# Altium project EM.PrjPcb
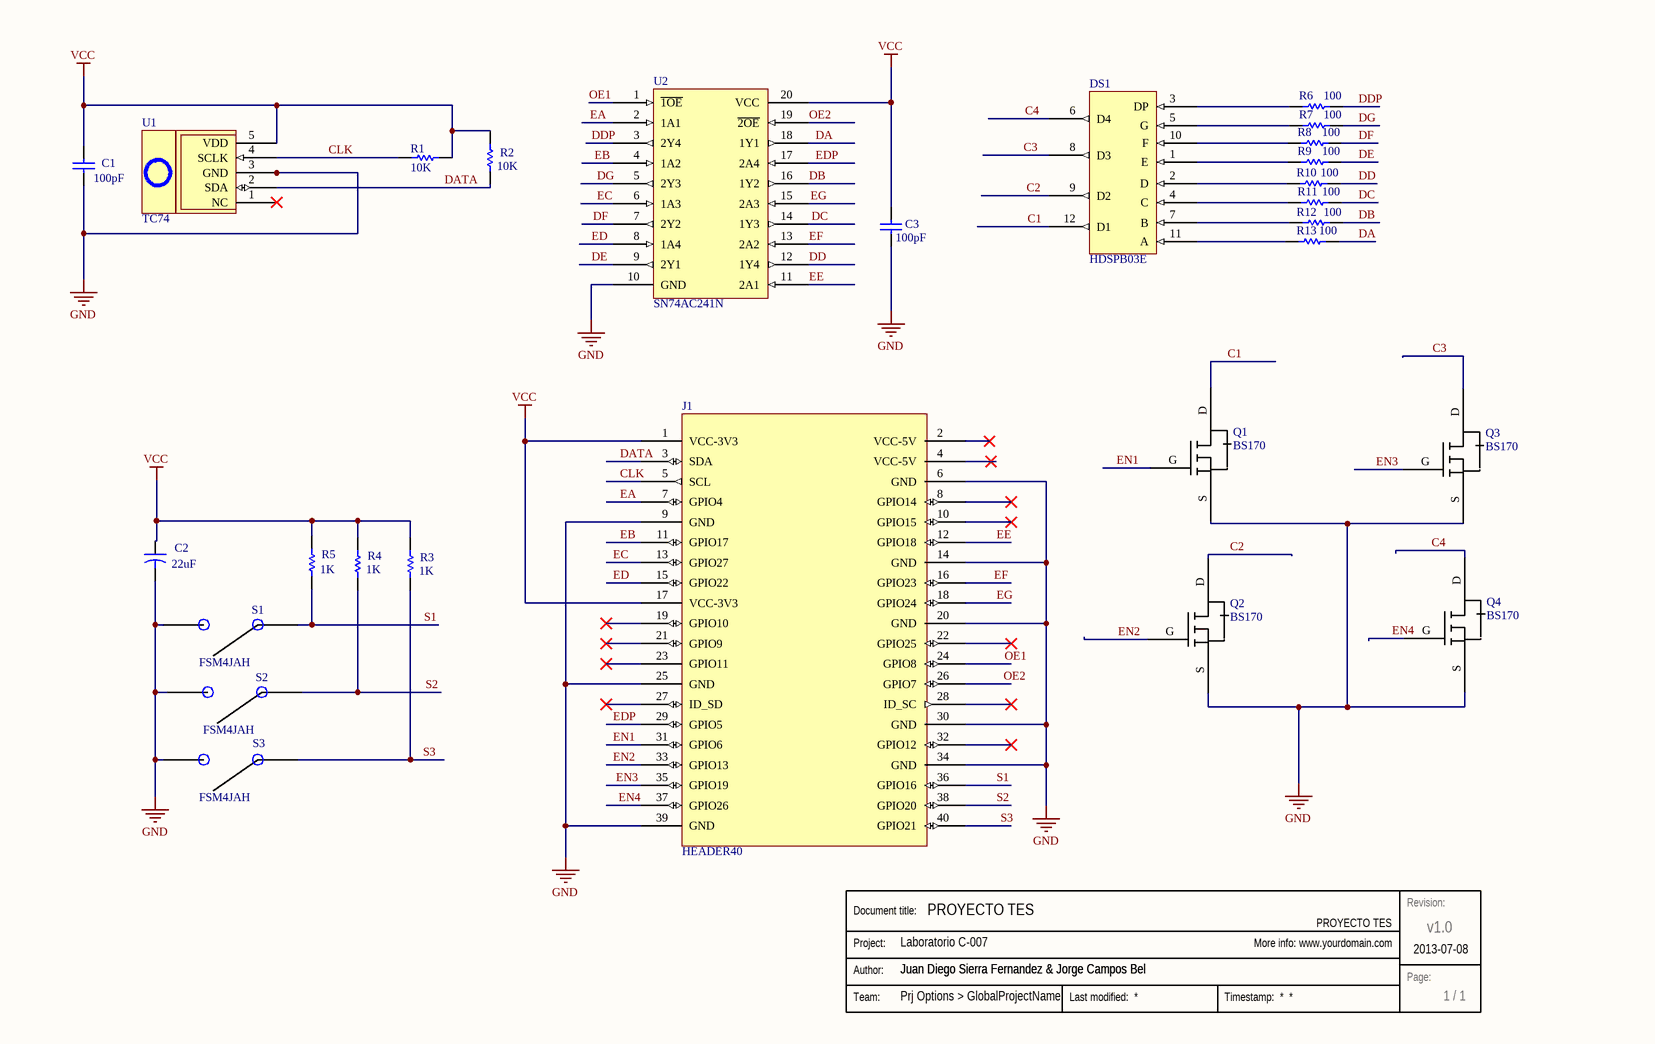
[diagram p0: TopLevel.SchDoc]
GlobalProjectLink: www.yourdomain.com; GlobalProjectName: Set in Project Options > Parameters > GlobalProjectName; GlobalProjectRevision: v1.0; GlobalProjectTeam: Prj Options > GlobalProjectName; GlobalRevisionDate: 2013-07-08
1 sheet, 28 parts. Net scope: global (net labels, ports and power ports of the same name join across sheets).
Board file: PCB2.PcbDoc

## Sheet TopLevel.SchDoc: PROYECTO TES
size A4; Author: Juan Diego Sierra Fernandez & Jorge Campos Bel; DocumentNumber: 1; SheetNumber: 1; SheetTotal: 1; GlobalProjectName: Laboratorio C-007; Team: TES; More info: www.eps.uam.es; Page: 1; DocumentName: PROYECTO TES; ProjectName: TES

### Parts
C1  value 100pF  [RAD-0.3]  (hidden comment: Cap)
C2  value 22uF  [CAPR5-4X5]  (hidden comment: Cap2)
C3  value 100pF  [RAD-0.3]  (hidden comment: Cap)
DS1  HDSPB03E  [DISPLAY]
J1  HEADER40  [DIP40]
Q1  BS170  [MOSFET]
Q2  BS170  [MOSFET]
Q3  BS170  [MOSFET]
Q4  BS170  [MOSFET]
R1  value 10K  [AXIAL-0.3]  (hidden comment: Res1)
R2  value 10K  [AXIAL-0.3]  (hidden comment: Res1)
R3  value 1K  [AXIAL-0.3]  (hidden comment: Res1)
R4  value 1K  [AXIAL-0.3]  (hidden comment: Res1)
R5  value 1K  [AXIAL-0.3]  (hidden comment: Res1)
R6  value 100  [AXIAL-0.3]  (hidden comment: Res1)
R7  value 100  [AXIAL-0.3]  (hidden comment: Res1)
R8  value 100  [AXIAL-0.3]  (hidden comment: Res1)
R9  value 100  [AXIAL-0.3]  (hidden comment: Res1)
R10  value 100  [AXIAL-0.3]  (hidden comment: Res1)
R11  value 100  [AXIAL-0.3]  (hidden comment: Res1)
R12  value 100  [AXIAL-0.3]  (hidden comment: Res1)
R13  value 100  [AXIAL-0.3]  (hidden comment: Res1)
S1  FSM4JAH  [SPST]
S2  FSM4JAH  [SPST]
S3  FSM4JAH  [SPST]
Stamp  Stamp  (value not drawn)  (graphical)
U1  TC74  [T0220]
U2  SN74AC241N  [SN74]

### Nets
GND: C1.1 C2.2 C3.1 J1.6(GND) J1.9(GND) J1.14(GND) J1.20(GND) J1.25(GND) J1.30(GND) J1.34(GND) J1.39(GND) Q1.S(Source) Q2.S(Source) Q3.S(Source) Q4.S(Source) S1.2 S2.2 S3.2 U1.3(GND) U2.10(GND)
VCC: C1.2 C2.1 C3.2 J1.1(VCC-3V3) J1.17(VCC-3V3) R1.1 R2.2 R3.2 R4.2 R5.2 U1.5(VDD) U2.20(VCC)
C1: DS1.12(D1) Q1.D(Drain)
C2: DS1.9(D2) Q2.D(Drain)
C3: DS1.8(D3) Q3.D(Drain)
C4: DS1.6(D4) Q4.D(Drain)
CLK: J1.5(SCL) R1.2 U1.4(SCLK)
DA: R13.2 U2.18(1Y1)
DATA: J1.3(SDA) R2.1 U1.2(SDA)
DB: R12.2 U2.16(1Y2)
DC: R11.2 U2.14(1Y3)
DD: R10.2 U2.12(1Y4)
DDP: R6.2 U2.3(2Y4)
DE: R9.2 U2.9(2Y1)
DF: R8.2 U2.7(2Y2)
DG: R7.2 U2.5(2Y3)
EA: J1.7(GPIO4) U2.2(1A1)
EB: J1.11(GPIO17) U2.4(1A2)
EC: J1.13(GPIO27) U2.6(1A3)
ED: J1.15(GPIO22) U2.8(1A4)
EDP: J1.29(GPIO5) U2.17(2A4)
EE: J1.12(GPIO18) U2.11(2A1)
EF: J1.16(GPIO23) U2.13(2A2)
EG: J1.18(GPIO24) U2.15(2A3)
EN1: J1.31(GPIO6) Q1.G(Gate)
EN2: J1.33(GPIO13) Q2.G(Gate)
EN3: J1.35(GPIO19) Q3.G(Gate)
EN4: J1.37(GPIO26) Q4.G(Gate)
OE1: J1.24(GPIO8) U2.1(~{1OE})
OE2: J1.26(GPIO7) U2.19(~{2OE})
S1: J1.36(GPIO16) R5.1 S1.1
S2: J1.38(GPIO20) R4.1 S2.1
S3: J1.40(GPIO21) R3.1 S3.1
NetDS1_1: DS1.1(E) R9.1
NetDS1_2: DS1.2(D) R10.1
NetDS1_3: DS1.3(DP) R6.1
NetDS1_4: DS1.4(C) R11.1
NetDS1_5: DS1.5(G) R7.1
NetDS1_7: DS1.7(B) R12.1
NetDS1_10: DS1.10(F) R8.1
NetDS1_11: DS1.11(A) R13.1

Not connected (* = marked no-connect by the designer): J1 2(VCC-5V)* 4(VCC-5V)* 8(GPIO14)* 10(GPIO15)* 19(GPIO10)* 21(GPIO9)* 22(GPIO25)* 23(GPIO11)* 27(ID_SD)* 28(ID_SC)* 32(GPIO12)*; U1 1(NC)*

### Notes on the sheet
- (in symbol Stamp) Revision:; Document title:; Project:; Author:; Page:; Team:

### Library data of the parts
C1 C3 = Cap: Capacitor; Published: 8-Jun-2000; LatestRevisionDate: 17-Jul-2002; LatestRevisionNote: Re-released for DXP Platform.; PackageReference: RAD-0.3; Publisher: Altium Limited; PackageDescription: Radial Cap, Thru-Hole; 2 Leads; 0.3 in Pin Spacing
C2 = Cap2: Capacitor; Published: 23-Sep-2002; PackageReference: CAPR5-4X5; Publisher: Altium Limited; PackageDescription: Capacitor; 2 Leads
DS1 = HDSPB03E: Display
J1 = HEADER40: Header
Q1-Q4 = BS170: Mosfet
R1-R13 = Res1: Resistor; Published: 8-Jun-2000; LatestRevisionDate: 17-Jul-2002; LatestRevisionNote: Re-released for DXP Platform.; PackageReference: AXIAL-0.3; Publisher: Altium Limited; PackageDescription: Axial Device, Thru-Hole; 2 Leads; 0.3 in Pin Spacing
S1-S3 = FSM4JAH: Switch
U1 = TC74: Sensor
U2 = SN74AC241N: Driver; Part Number: SN74AC241N